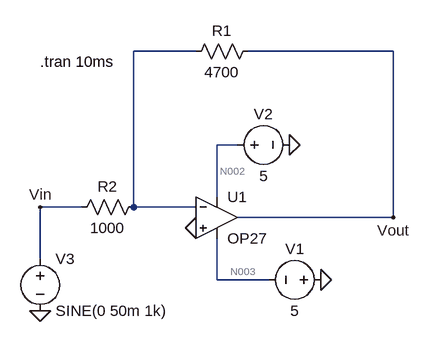
[diagram p0: schematic circuit-1.asc]
circuit-1.asc, the LTspice schematic file:
Version 4.1
SHEET 1 880 680
WIRE 112 -160 16 -160
WIRE 416 -160 192 -160
WIRE 176 -16 144 -16
WIRE 144 64 144 -16
WIRE -64 80 -128 80
WIRE 16 80 16 -160
WIRE 112 80 16 80
WIRE 416 96 416 -160
WIRE 416 96 176 96
WIRE -128 160 -128 80
WIRE 144 192 144 128
WIRE 224 192 144 192
FLAG 256 -16 0
FLAG 304 192 0
FLAG -128 240 0
FLAG 416 96 Vout
FLAG -128 80 Vin
FLAG 112 112 0
SYMBOL OpAmps\\OP27 144 32 R0
SYMATTR InstName U1
SYMBOL voltage 320 192 R90
WINDOW 0 -32 56 VBottom 2
WINDOW 3 32 56 VTop 2
WINDOW 123 0 0 Left 0
WINDOW 39 0 0 Left 0
SYMATTR InstName V1
SYMATTR Value 5
SYMBOL voltage 160 -16 R270
WINDOW 0 32 56 VTop 2
WINDOW 3 -32 56 VBottom 2
WINDOW 123 0 0 Left 0
WINDOW 39 0 0 Left 0
SYMATTR InstName V2
SYMATTR Value 5
SYMBOL res 208 -176 R90
WINDOW 0 0 56 VBottom 2
WINDOW 3 32 56 VTop 2
SYMATTR InstName R1
SYMATTR Value 4700
SYMBOL res 32 64 R90
WINDOW 0 0 56 VBottom 2
WINDOW 3 32 56 VTop 2
SYMATTR InstName R2
SYMATTR Value 1000
SYMBOL voltage -128 144 R0
WINDOW 123 0 0 Left 0
WINDOW 39 0 0 Left 0
SYMATTR InstName V3
SYMATTR Value SINE(0 50m 1k)
TEXT -128 -144 Left 2 !.tran 10ms

The netlist it stands for:
* circuit-1.asc
X§U1 0 N001 N002 N003 Vout OP27  ; pins In+ In- V+ V- OUT
V1 0 N003 5
V2 N002 0 5
R1 Vout N001 4700
R2 N001 Vin 1000
V3 Vin 0 SINE(0 50m 1k)
.tran 10ms
.lib ADI.lib
.backanno
.end

* Results of the author's LTspice run, read from the files saved beside the schematic
* Operating Point, zero values left out:
*   V(n002) = 5 V
*   V(n003) = -5 V
*   I(V1) = -2.468 mA
*   I(V2) = -2.468 mA
*   Ix(u1:3) = 2.468 mA
*   Ix(u1:4) = -2.468 mA
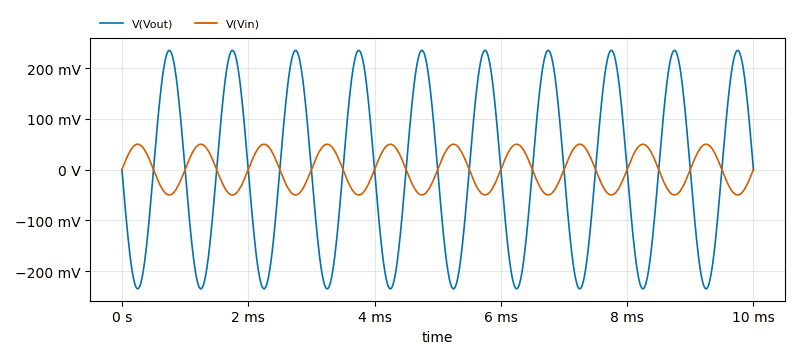
[diagram p1: Transient Analysis of circuit-1.asc, plotted from the saved traces]
* Transient Analysis, 1 run:
*   V(Vout): min -235 mV, max 235 mV, average 0 V, rms 166.2 mV, last 163 µV
*   V(Vin): min -50 mV, max 50 mV, average 0 V, rms 35.36 mV, last 0 V